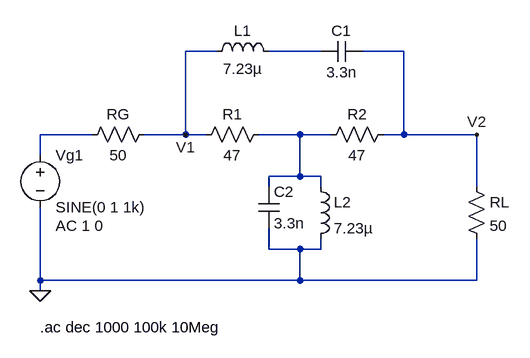
[diagram p0: schematic impedancia_constante.asc]
impedancia_constante.asc, the LTspice schematic file:
Version 4
SHEET 1 880 836
WIRE 368 -16 320 -16
WIRE 528 -16 448 -16
WIRE 656 -16 592 -16
WIRE 176 112 96 112
WIRE 320 112 320 -16
WIRE 320 112 256 112
WIRE 352 112 320 112
WIRE 496 112 432 112
WIRE 544 112 496 112
WIRE 656 112 656 -16
WIRE 656 112 624 112
WIRE 768 112 656 112
WIRE 96 144 96 112
WIRE 496 176 496 112
WIRE 496 176 448 176
WIRE 528 176 496 176
WIRE 448 192 448 176
WIRE 528 192 528 176
WIRE 768 192 768 112
WIRE 448 288 448 256
WIRE 496 288 448 288
WIRE 528 288 528 272
WIRE 528 288 496 288
WIRE 96 336 96 224
WIRE 496 336 496 288
WIRE 496 336 96 336
WIRE 768 336 768 272
WIRE 768 336 496 336
WIRE 96 352 96 336
FLAG 96 352 0
FLAG 768 112 V2
FLAG 320 112 V1
SYMBOL voltage 96 128 R0
WINDOW 123 24 124 Left 2
WINDOW 39 0 0 Left 0
SYMATTR Value2 AC 1 0
SYMATTR InstName Vg1
SYMATTR Value SINE(0 1 1k)
SYMBOL res 272 96 R90
WINDOW 0 0 56 VBottom 2
WINDOW 3 32 56 VTop 2
SYMATTR InstName RG
SYMATTR Value 50
SYMBOL res 448 96 R90
WINDOW 0 0 56 VBottom 2
WINDOW 3 32 56 VTop 2
SYMATTR InstName R1
SYMATTR Value 47
SYMBOL res 640 96 R90
WINDOW 0 0 56 VBottom 2
WINDOW 3 32 56 VTop 2
SYMATTR InstName R2
SYMATTR Value 47
SYMBOL res 752 176 R0
SYMATTR InstName RL
SYMATTR Value 50
SYMBOL ind 352 0 R270
WINDOW 0 32 56 VTop 2
WINDOW 3 5 56 VBottom 2
SYMATTR InstName L1
SYMATTR Value 7.23µ
SYMBOL cap 528 0 R270
WINDOW 0 32 32 VTop 2
WINDOW 3 0 32 VBottom 2
SYMATTR InstName C1
SYMATTR Value 3.3n
SYMBOL ind 512 176 R0
SYMATTR InstName L2
SYMATTR Value 7.23µ
SYMBOL cap 432 192 R0
SYMATTR InstName C2
SYMATTR Value 3.3n
TEXT 96 408 Left 2 !.ac dec 1000 100k 10Meg

The netlist it stands for:
* impedancia_constante.asc
Vg1 N002 0 SINE(0 1 1k) AC 1 0
RG V1 N002 50
R1 N003 V1 47
R2 V2 N003 47
RL V2 0 50
L1 V1 N001 7.23µ
C1 N001 V2 3.3n
L2 N003 0 7.23µ
C2 N003 0 3.3n
.ac dec 1000 100k 10Meg
.backanno
.end